# Altium schematic sheet menu_SCH.SchDoc
size A
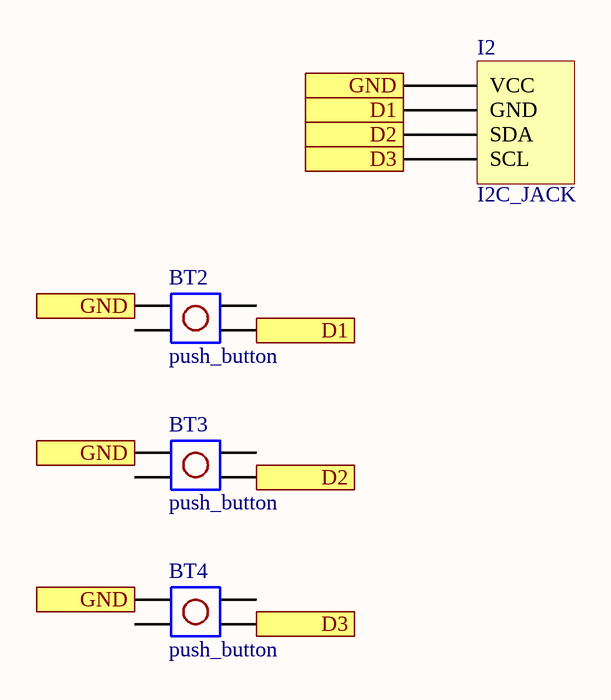
[diagram p0: menu_SCH.SchDoc]

## Parts
BT2  push_button  [DIP_button]
BT3  push_button  [DIP_button]
BT4  push_button  [DIP_button]
I2  I2C_JACK  [4PIN_JST]

## Ports
D1, D2, D3, GND

## Nets
D1: BT2.4 I2.2(GND) ; port D1
D2: BT3.4 I2.3(SDA) ; port D2
D3: BT4.4 I2.4(SCL) ; port D3
GND: BT2.1 BT3.1 BT4.1 I2.1(VCC) ; port GND

Not connected (* = marked no-connect by the designer): BT2 2 3; BT3 2 3; BT4 2 3

## Library data of the parts
BT2-BT4 = push_button: DIP tacttil push button